# EAGLE design FPC-EMC01-1284 (EAGLE 6.6.0)
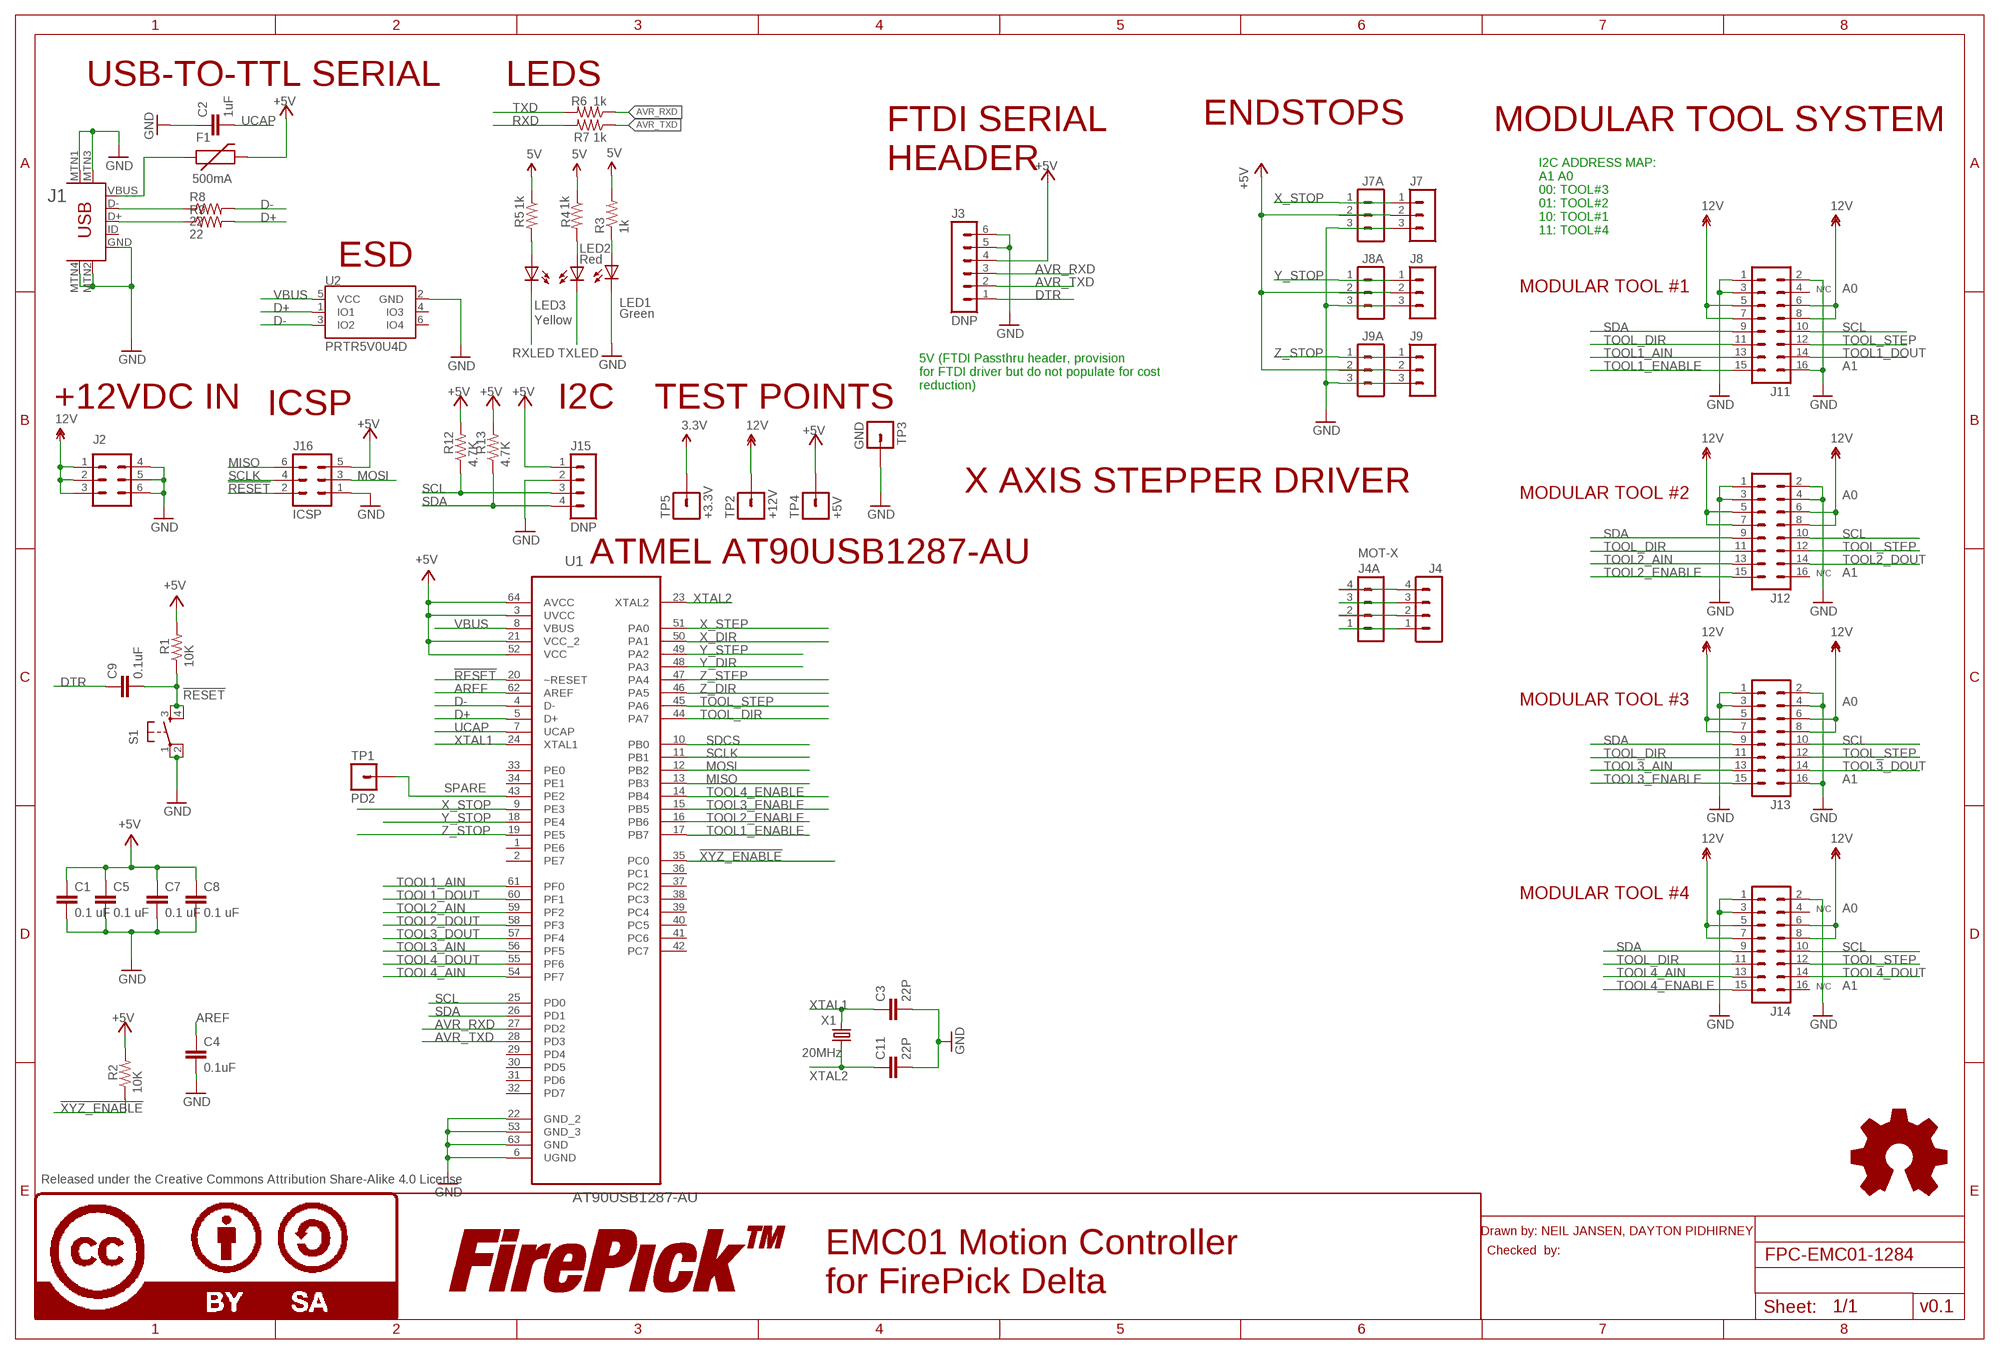
[diagram p0: schematic, sheet 1]

## Parts
C1  0.1 uF  CAP0805  [0805]
C2  1uF  CAP0805  [0805]
C3  22P  CAP0805  [0805]
C4  0.1uF  CAP0805  [0805]
C5  0.1 uF  CAP0805  [0805]
C7  0.1 uF  CAP0805  [0805]
C8  0.1 uF  CAP0805  [0805]
C9  0.1uF  CAP0805  [0805]
C11  22P  CAP0805  [0805]
F1  500mA  PTCSMD  [PTC-1206]
J1  USB-MINIB-5PIN  [USB-MINIB]
J2  CONN-MOLEX-MICROFIT-6PIN  [CONN-MOLEX-MINIFIT-6PIN-2ROW]
J3  DNP  MA06-1  [MA06-1]
J4  MA04-1  [MA04-1]
J4A  MOT-X  CONN-RECT-4PINJST-PH-2MM  [CONN-JST-PH_2.0MM_4PIN-SMT-RA]
J7  MA03-1  [MA03-1]
J7A  CONN-RECT-3PINJST_PH_2MM  [CONN-JST_PH-2.0MM-3PIN-SMT-RA]
J8  MA03-1  [MA03-1]
J8A  CONN-RECT-3PINJST_PH_2MM  [CONN-JST_PH-2.0MM-3PIN-SMT-RA]
J9  MA03-1  [MA03-1]
J9A  CONN-RECT-3PINJST_PH_2MM  [CONN-JST_PH-2.0MM-3PIN-SMT-RA]
J11  CONN-RECT-16PIN-2ROW  [CONN-RECT-2.54MM-16PIN-2ROW-SMTH]
J12  CONN-RECT-16PIN-2ROW  [CONN-RECT-2.54MM-16PIN-2ROW-SMTH]
J13  CONN-RECT-16PIN-2ROW  [CONN-RECT-2.54MM-16PIN-2ROW-SMTH]
J14  CONN-RECT-16PIN-2ROW  [CONN-RECT-2.54MM-16PIN-2ROW-SMTH]
J15  DNP  MA04-1  [MA04-1]
J16  ICSP  CONN-RECT-6PIN-2ROW  [CONN-RECT-2.54MM-6-PIN-2ROW-SMTH]
LED1  Green  LED1206-NS  [LED-1206-NO_SILK]
LED2  Red  LED1206-NS  [LED-1206-NO_SILK]
LED3  Yellow  LED1206-NS  [LED-1206-NO_SILK]
LOGO4  LOGO-FIREPICKLARGE  [LOGO-FIREPICK]
LOGO5  LOGO-OSHWMEDIUM  [LOGO-OSHW-MEDIUM]
LOGO6  LOGO-CC-BY-SALARGE  [LOGO-CC-BY-SA]
R1  10K  RESISTOR0805-RES  [0805]
R2  10K  RESISTOR0805-RES  [0805]
R3  1k  RESISTOR0805-RES  [0805]
R4  1k  RESISTOR0805-RES  [0805]
R5  1k  RESISTOR0805-RES  [0805]
R6  1k  RESISTOR0805-RES  [0805]
R7  1k  RESISTOR0805-RES  [0805]
R8  22  RESISTOR0805-RES  [0805]
R9  22  RESISTOR0805-RES  [0805]
R12  4.7K  RESISTOR0805-RES  [0805]
R13  4.7K  RESISTOR0805-RES  [0805]
S1  TAC_SWITCHSMD  [TACTILE_SWITCH_SMD]
TP1  PD2  CONN-TESTPOINT  [CON-TESTPOINT]
TP2  +12V  CONN-TESTPOINT  [CON-TESTPOINT]
TP3  GND  CONN-TESTPOINT  [CON-TESTPOINT]
TP4  +5V  CONN-TESTPOINT  [CON-TESTPOINT]
TP5  +3.3V  CONN-TESTPOINT  [CON-TESTPOINT]
U1  AT90USB1287-AU  [QFP80P1600X1600X120-64N]
U2  PRTR5V0U4D  [SOT23-6]
X1  20MHz  CRYSTALCTS406  [CTS406]

## Nets
3.3V: TP5.1
12V: J2.1 J2.2 J2.3 J11.5 J11.6 J11.7 J11.8 J12.5 J12.6 J12.7 J12.8 J13.5 J13.6 J13.7 J13.8 J14.5 J14.6 J14.7 J14.8 TP2.1
!RESET: C9.2 J16.2 R1.1 S1.3 S1.4 U1.20(~RESET)
!XYZ_ENABLE: R2.1 U1.35(PC0)
+5V [power]: C1.1 C5.1 C7.1 C8.1 F1.2 J3.4 J7.2 J7A.2 J8.2 J8A.2 J9.2 J9A.2 J15.1 J16.5 R1.2 R2.2 R3.2 R4.1 R5.1 R12.2 R13.2 TP4.1 U1.3(UVCC) U1.21(VCC_2) U1.52(VCC) U1.64(AVCC) ; supply symbol labelled 5V
AREF: C4.1 U1.62(AREF)
AVR_RXD: J3.3 R6.1 U1.27(PD2)
AVR_TXD: J3.2 R7.1 U1.28(PD3)
D+: R9.2 U1.5(D+) U2.1(IO1)
D-: R8.2 U1.4(D-) U2.3(IO2)
DTR: C9.1 J3.1
GND [power]: C1.2 C2.1 C3.2 C4.2 C5.2 C7.2 C8.2 C11.2 J1.GND J1.MTN1(MTN2) J1.MTN2(MTN3) J1.MTN3(MTN1) J1.MTN4 J2.4 J2.5 J2.6 J3.5 J3.6 J7.3 J7A.3 J8.3 J8A.3 J9.3 J9A.3 J11.1 J11.2 J11.3 J11.16 J12.1 J12.2 J12.3 J12.4 J13.1 J13.2 J13.3 J13.4 J13.16 J14.1 J14.2 J14.3 J15.2 J16.1 LED1.C S1.1 S1.2 TP3.1 U1.6(UGND) U1.22(GND_2) U1.53(GND_3) U1.63(GND) U2.2(GND)
MISO: J16.6 U1.13(PB3)
MOSI: J16.3 U1.12(PB2)
N$1: J1.D- R8.1
N$2: J1.D+ R9.1
N$4: LED1.A R3.1
N$21: LED2.A R4.2
N$22: LED3.A R5.2
RXD: R7.2
RXLED: LED3.C
SCL [power]: J11.10 J12.10 J13.10 J14.10 J15.3 R12.1 U1.25(PD0)
SCLK: J16.4 U1.11(PB1)
SDA [power]: J11.9 J12.9 J13.9 J14.9 J15.4 R13.1 U1.26(PD1)
SDCS: U1.10(PB0)
SPARE: TP1.1 U1.43(PE2)
TOOL1_AIN: J11.13 U1.61(PF0)
TOOL1_DOUT: J11.14 U1.60(PF1)
TOOL1_ENABLE: J11.15 U1.17(PB7)
TOOL2_AIN: J12.13 U1.59(PF2)
TOOL2_DOUT: J12.14 U1.58(PF3)
TOOL2_ENABLE: J12.15 U1.16(PB6)
TOOL3_AIN: J13.13 U1.56(PF5)
TOOL3_DOUT: J13.14 U1.57(PF4)
TOOL3_ENABLE: J13.15 U1.15(PB5)
TOOL4_AIN: J14.13 U1.54(PF7)
TOOL4_DOUT: J14.14 U1.55(PF6)
TOOL4_ENABLE: J14.15 U1.14(PB4)
TOOL_DIR: J11.11 J12.11 J13.11 J14.11 U1.44(PA7)
TOOL_STEP: J11.12 J12.12 J13.12 J14.12 U1.45(PA6)
TXD: R6.2
TXLED: LED2.C
UCAP: C2.2 U1.7(UCAP)
VBUS: U1.8(VBUS) U2.5(VCC)
VUSB: F1.1 J1.VBUS
X1A: J4.2 J4A.2
X1B: J4.1 J4A.1
X2A: J4.3 J4A.3
X2B: J4.4 J4A.4
X_DIR: U1.50(PA1)
X_STEP: U1.51(PA0)
X_STOP: J7.1 J7A.1 U1.9(PE3)
XTAL1: C3.1 U1.24(XTAL1) X1.3
XTAL2: C11.1 U1.23(XTAL2) X1.1
Y_DIR: U1.48(PA3)
Y_STEP: U1.49(PA2)
Y_STOP: J8.1 J8A.1 U1.18(PE4)
Z_DIR: U1.46(PA5)
Z_STEP: U1.47(PA4)
Z_STOP: J9.1 J9A.1 U1.19(PE5)
Unconnected: J1.ID J11.4 J12.16 J14.4 J14.16 U1.1(PE6) U1.2(PE7) U1.29(PD4) U1.30(PD5) U1.31(PD6) U1.32(PD7) U1.33(PE0) U1.34(PE1) U1.36(PC1) U1.37(PC2) U1.38(PC3) U1.39(PC4) U1.40(PC5) U1.41(PC6) U1.42(PC7) U2.4(IO3) U2.6(IO4)

## Notes on the sheet
- USB-TO-TTL SERIAL | LEDS
- ENDSTOPS | MODULAR TOOL SYSTEM
- FTDI SERIAL 
  HEADER
- J1
- I2C ADDRESS MAP:
  A1 A0
  00: TOOL#3
  01: TOOL#2
  10: TOOL#1
  11: TOOL#4
- ESD
- MODULAR TOOL #1 | N/C | A0
- A1
- 5V (FTDI Passthru header, provision
  for FTDI driver but do not populate for cost
  reduction)
- +12VDC IN | ICSP | I2C | TEST POINTS
- X AXIS STEPPER DRIVER
- MODULAR TOOL #2 | A0
- ATMEL AT90USB1287-AU
- N/C | A1
- MODULAR TOOL #3 | A0
- A1
- MODULAR TOOL #4
- N/C | A0
- N/C | A1
- Released under the Creative Commons Attribution Share-Alike 4.0 License
- Drawn by: NEIL JANSEN, DAYTON PIDHIRNEY
- Checked  by:
- EMC01 Motion Controller
  for FirePick Delta
- v0.1

## Library data of the parts
C1 C3-C5 C7-C9 C11 = SparkFun-Capacitors:CAP: Capacitor Standard 0603 ceramic capacitor, and 0.1" leaded capacitor.
C2 = SparkFun:CAP: Capacitor Standard 0603 ceramic capacitor, and 0.1" leaded capacitor.
F1 = SparkFun:PTC: Resettable Fuse PTC Resettable Fuse. Spark Fun Electronics SKU : COM-08357
J1 = SparkFun-Connectors:USB-MINIB: Mini-USB "B" connector with 5th pin broken out. Created new symbol breaking out 5th "ID" pin in mini/micro USB connector spec. See: http://en.wikipedia.org/wiki/Mini_usb#Cables. Uses same footprint as 4-pin symbol. Also added pins to connect to mounting / shield pads if required (probably not generally needed as signals aren't shielded once they leave the connector).
J2 = FirePick:CONN-MOLEX-MICROFIT-6PIN
J3 = !con-lstb:MA06-1: PIN HEADER
J4 J15 = !con-lstb:MA04-1: PIN HEADER
J4A = FirePick:CONN-RECT-4PIN
J7-J9 = !con-lstb:MA03-1: PIN HEADER
J7A J8A J9A = FirePick:CONN-RECT-3PIN
J11-J14 = FirePick:CONN-RECT-16PIN-2ROW
J16 = FirePick:CONN-RECT-6PIN-2ROW
LED1-LED3 = SparkFun-LED:LED: LEDs Standard schematic elements and footprints for 5mm, 3mm, 1206, and 0603 sized LEDs. 5mm - Spark Fun Electronics SKU : COM-00529 (and others)
LOGO4 = FirePick:LOGO-FIREPICK
LOGO5 = FirePick:LOGO-OSHW
LOGO6 = FirePick:LOGO-CC-BY-SA
R1-R7 R12 R13 = SparkFun-Resistors:RESISTOR: Resistor Basic schematic elements and footprints for 0603, 1206, and PTH resistors.
R8 R9 = SparkFun:RESISTOR: Resistor Basic schematic elements and footprints for 0603, 1206, and PTH resistors.
S1 = SparkFun:TAC_SWITCH: Momentary Switch Button commonly used for reset or general input. Spark Fun Electronics SKU : COM-00097
TP1-TP5 = FirePick:CONN-TESTPOINT
U1 = Atmel_By_element14_Batch_1-00:AT90USB1287-AU: MCU; DESCRIPTION: MCU; MPN: AT90USB1287-AU; OC_FARNELL: 1748496; OC_NEWARK: 26R5676; PACKAGE: QFP-64; SUPPLIER: Atmel
U2 = printrbot:PRTR5V0U4D
X1 = adafruit:CRYSTAL: CRYSTAL; OC_FARNELL: unknown; OC_NEWARK: unknown

## Net classes
2 power-12V: width 0.3 mm, drill 0.3 mm, clearance 0.3 mm

## Board
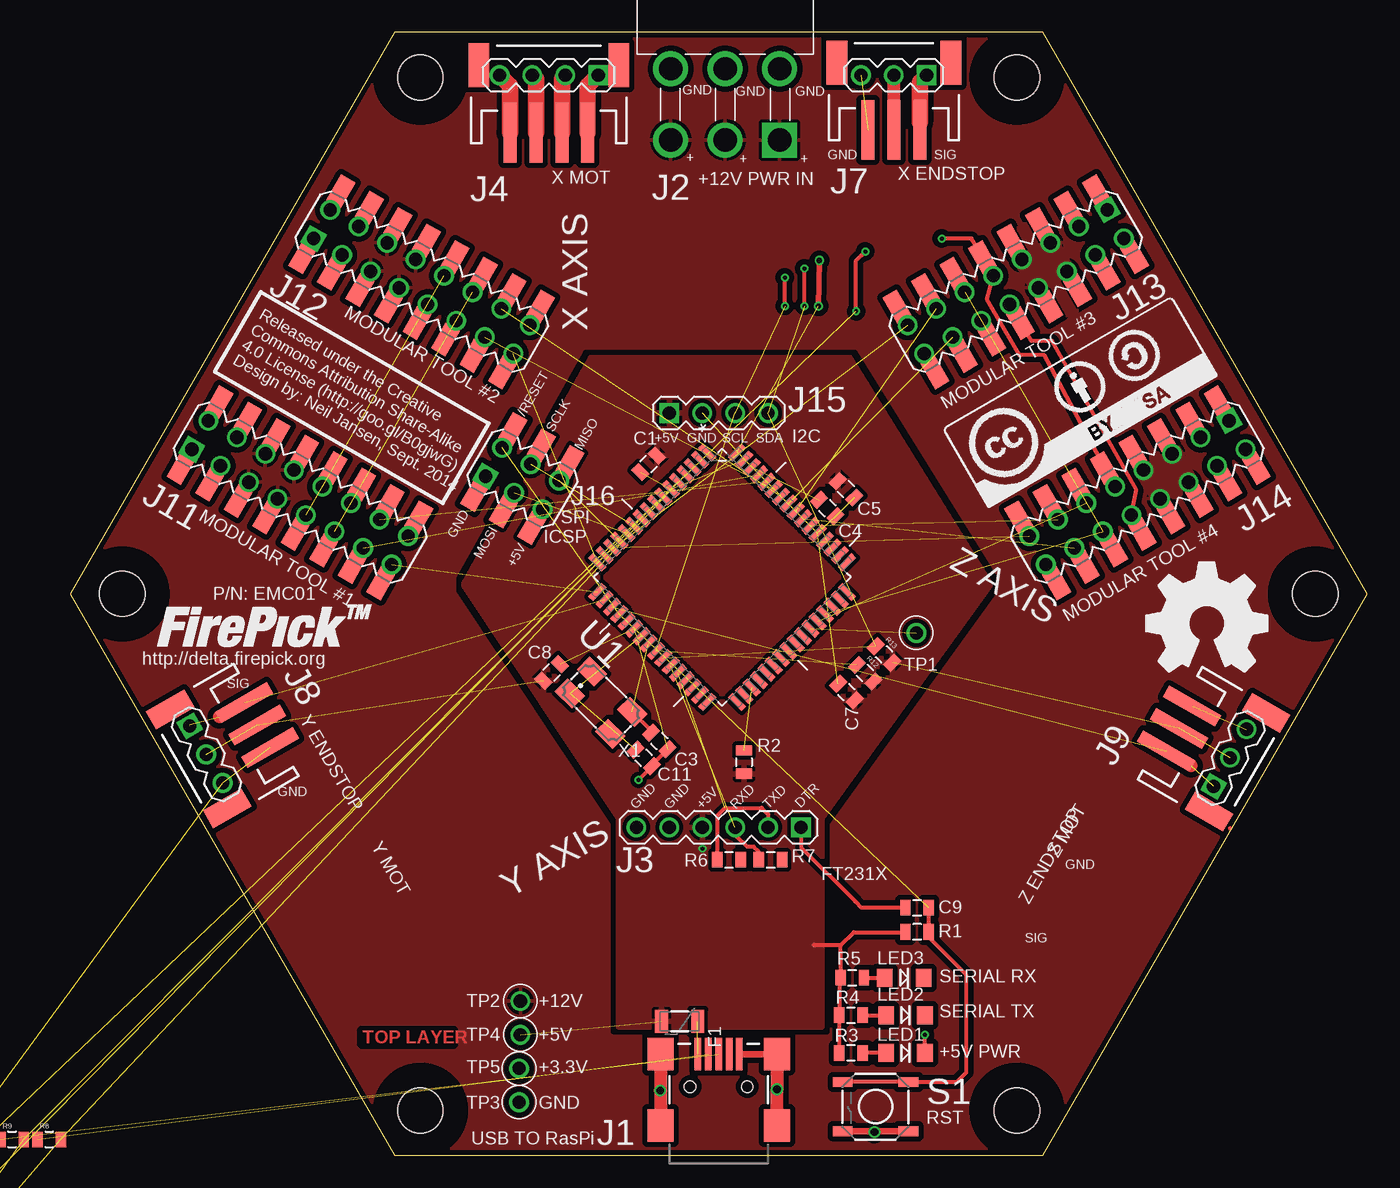
[diagram p1: board, top side]
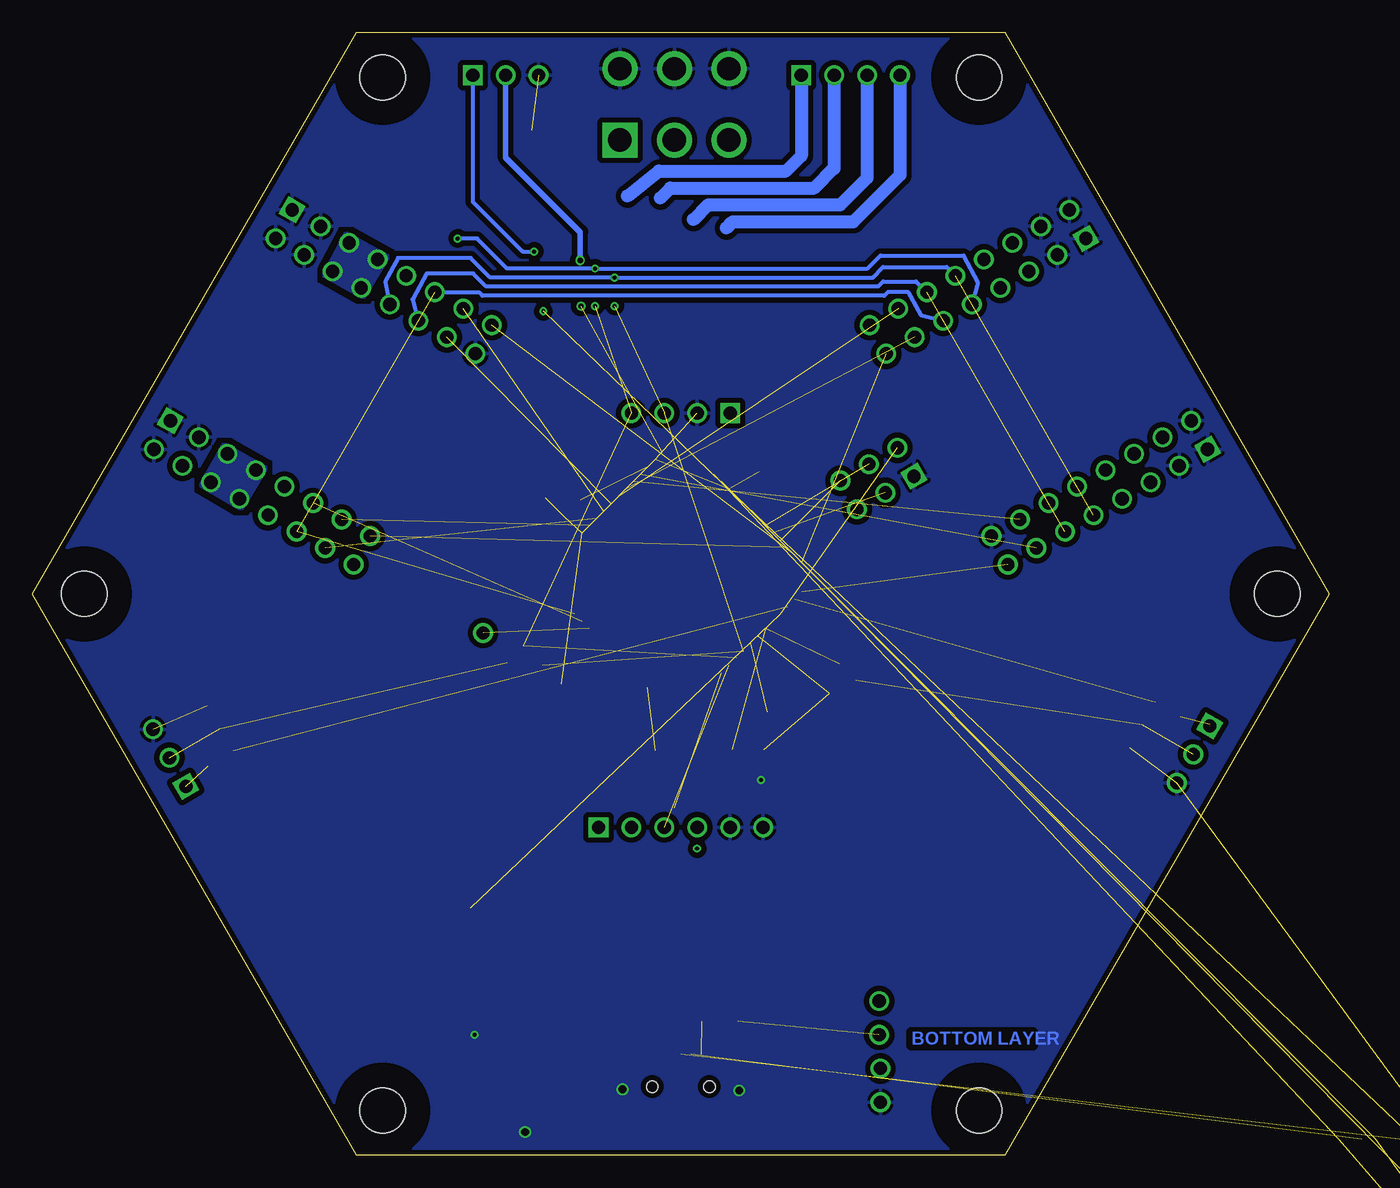
[diagram p2: board, bottom side, seen from below]

Size 100 x 86.6 mm. Coordinates in mm from the lower left corner, seen from the top.
Outline: 25,0 75,0 100,43.3 75,86.6 25,86.6 0,43.3 25,0
Copper layers (1*16): Top 0.035mm / dielectric 1.5mm / Bottom 0.035mm
Design rules "SeeedStudio_2layer_DRU_no_angle_20140221": minimum track width 6mil, minimum drill 12mil, track to track 6mil, track to pad 6mil, pad to pad 6mil, via to via 6mil, smd to smd 0mil, copper to edge 10mil, drill to drill 10mil, minimum pad ring 10mil, minimum via ring 6mil, stop-mask expansion 2mil, vias tented up to drill 100mil, thermal gap 10mil
Holes 3.5 mm at 4,43.3 27,3.46 73,3.46 96,43.3 27,83.14 73,83.14
tRestrict: area 92.8,40.1 to 99.2,46.6; area 0.8,40.1 to 7.2,46.6; area 69.8,0.2 to 76.2,6.7; area 23.8,79.9 to 30.2,86.4; area 69.8,79.9 to 76.2,86.4; area 23.8,0.2 to 30.2,6.7
bRestrict: area 0.8,40.1 to 7.2,46.6; area 69.8,79.9 to 76.2,86.4; area 92.8,40.1 to 99.2,46.6; area 23.8,0.2 to 30.2,6.7; area 69.8,0.2 to 76.2,6.7; area 23.8,79.9 to 30.2,86.4

### Footprints (pad centres in the part's own frame; a part is rotated, then mirrored left to right if it is on the bottom)
0805 = smd 0.8 x 1.2: 1 -0.9,0; 2 0.9,0
PTC-1206 = smd 1 x 1.8: 1 -1.4,0; 2 1.4,0
USB-MINIB = smd 2.5 x 0.5: D+ 2.5,0; D- 2.5,0.8; GND 2.5,-1.6; ID 2.5,-0.8; VBUS 2.5,1.6 | smd 2.5 x 2: MTN1 -3,4.5; MTN2 2.5,4.5; MTN3 -3,-4.5; MTN4 2.5,-4.5 | hole 0.9: 0,2.2; 0,-2.2
CONN-MOLEX-MINIFIT-6PIN-2ROW = drill 1.8 square: 1 4.2,0 | drill 1.8: 2 0,0; 3 -4.2,0; 4 4.2,5.5; 5 0,5.5; 6 -4.2,5.5
MA06-1 = drill 1.016 square: 1 -6.35,0 | drill 1.016: 2 -3.81,0; 3 -1.27,0; 4 1.27,0; 5 3.81,0; 6 6.35,0
MA04-1 = drill 1.016 square: 1 -3.81,0 | drill 1.016: 2 -1.27,0; 3 1.27,0; 4 3.81,0
CONN-JST-PH_2.0MM_4PIN-SMT-RA = smd 1 x 4.6: 1 3,-2.43; 2 1,-2.43; 3 -1,-2.43; 4 -3,-2.43 | smd 1.6 x 3.4: NC1 -5.4,2.77; NC2 5.4,2.77
MA03-1 = drill 1.016 square: 1 -2.54,0 | drill 1.016: 2 0,0; 3 2.54,0
CONN-JST_PH-2.0MM-3PIN-SMT-RA = smd 1 x 4.6: 1 2.01,-2.23; 2 0.01,-2.23; 3 -1.99,-2.23 | smd 1.6 x 3.4: NC1 -4.39,2.97; NC2 4.41,2.97
CONN-RECT-2.54MM-16PIN-2ROW-SMTH = drill 1.016 square: 1 -8.89,-1.27 | drill 1.016: 2 -8.89,1.27; 3 -6.35,-1.27; 4 -6.35,1.27; 5 -3.81,-1.27; 6 -3.81,1.27; 7 -1.27,-1.27; 8 -1.27,1.27; 9 1.27,-1.27; 10 1.27,1.27; 11 3.81,-1.27; 12 3.81,1.27; 13 6.35,-1.27; 14 6.35,1.27; 15 8.89,-1.27; 16 8.89,1.27 | smd 1.27 x 2.3: P1 -8.89,-2.93; P2 -8.89,2.93; P3 -6.35,-2.93; P4 -6.35,2.93; P5 -3.81,-2.93; P6 -3.81,2.93; P7 -1.27,-2.93; P8 -1.27,2.93; P9 1.27,-2.93; P10 1.27,2.93; P11 3.81,-2.93; P12 3.81,2.93; P13 6.35,-2.93; P14 6.35,2.93; P15 8.89,-2.93; P16 8.89,2.93
CONN-RECT-2.54MM-6-PIN-2ROW-SMTH = drill 1.016 square: 1 -2.54,-1.27 | drill 1.016: 2 -2.54,1.27; 3 0,-1.27; 4 0,1.27; 5 2.54,-1.27; 6 2.54,1.27 | smd 1.27 x 2.3: P1 -2.54,-2.93; P2 -2.54,2.93; P3 0,-2.93; P4 0,2.93; P5 2.54,-2.93; P6 2.54,2.93
LED-1206-NO_SILK = smd 1.2 x 1.4: A -1.5,0; C 1.5,0
TACTILE_SWITCH_SMD = smd 1.524 x 0.762: 1 -2.54,1.905; 2 2.54,1.905; 3 -2.54,-1.905; 4 2.54,-1.905
CON-TESTPOINT = drill 1.016: 1 0,0
QFP80P1600X1600X120-64N = smd 1.473 x 0.508: 1 -7.62,5.994; 2 -7.62,5.207; 3 -7.62,4.394; 4 -7.62,3.607; 5 -7.62,2.794; 6 -7.62,2.007; 7 -7.62,1.194; 8 -7.62,0.406; 9 -7.62,-0.406; 10 -7.62,-1.194; 11 -7.62,-2.007; 12 -7.62,-2.794; 13 -7.62,-3.607; 14 -7.62,-4.394; 15 -7.62,-5.207; 16 -7.62,-5.994; 33 7.62,-5.994; 34 7.62,-5.207; 35 7.62,-4.394; 36 7.62,-3.607; 37 7.62,-2.794; 38 7.62,-2.007; 39 7.62,-1.194; 40 7.62,-0.406; 41 7.62,0.406; 42 7.62,1.194; 43 7.62,2.007; 44 7.62,2.794; 45 7.62,3.607; 46 7.62,4.394; 47 7.62,5.207; 48 7.62,5.994 | smd 0.508 x 1.473: 17 -5.994,-7.62; 18 -5.207,-7.62; 19 -4.394,-7.62; 20 -3.607,-7.62; 21 -2.794,-7.62; 22 -2.007,-7.62; 23 -1.194,-7.62; 24 -0.406,-7.62; 25 0.406,-7.62; 26 1.194,-7.62; 27 2.007,-7.62; 28 2.794,-7.62; 29 3.607,-7.62; 30 4.394,-7.62; 31 5.207,-7.62; 32 5.994,-7.62; 49 5.994,7.62; 50 5.207,7.62; 51 4.394,7.62; 52 3.607,7.62; 53 2.794,7.62; 54 2.007,7.62; 55 1.194,7.62; 56 0.406,7.62; 57 -0.406,7.62; 58 -1.194,7.62; 59 -2.007,7.62; 60 -2.794,7.62; 61 -3.607,7.62; 62 -4.394,7.62; 63 -5.207,7.62; 64 -5.994,7.62
SOT23-6 = smd 0.6 x 0.9: 1 -0.95,-1.15; 2 0,-1.15; 3 0.95,-1.15; 4 0.95,1.15; 5 0,1.15; 6 -0.95,1.15
CTS406 = smd 1.9 x 1.4: 1 -2.2,-1.2; 2 2.2,-1.2; 3 2.2,1.2; 4 -2.2,1.2

### Placement (x,y rotation side)
C1  44.59,53.33 225 top
C2  -7.52,1.23 0 top  (outside the outline)
C3  45.42,31.95 315 top
C4  58.37,49.92 315 top
C5  59.82,51.37 315 top
C7  59.84,35.73 135 top
C8  37.12,37.25 45 top
C9  65.3,19.1 0 top
C11  44.22,30.65 315 top
F1  46.98,10.34 180 top
J1  50,5.3 90 top
J2  50.5,78.3 0 top
J3  50,25.3 180 top
J4  36.9,83.3 180 top
J4A  36.9,81.3 0 top
J7  63.5,83.3 180 top
J7A  63.5,81.3 0 top
J8  10.48,30.93 300 top
J8A  12.48,32.05 120 top
J9  89.43,30.66 60 top
J9A  87.44,31.81 240 top
J11  17.7,51.11 330 top
J12  27.09,67.37 330 top
J13  72.91,67.37 210 top
J14  82.3,51.11 210 top
J15  50,57.25 0 top
J16  34.85,52.2 330 top
LED1  64.4,7.9 0 top
LED2  64.4,10.8 0 top
LED3  64.3,13.7 0 top
LOGO4  6.5,37.5 0 top
LOGO5  87.65,41.07 0 top
LOGO6  70.8,49.9 30 top
R1  65.3,17.23 180 top
R2  51.95,30.33 270 top
R3  60.2,7.9 180 top
R4  60.2,10.8 0 top
R5  60.3,13.7 0 top
R6  54,22.8 0 top
R7  50.8,22.8 0 top
R8  -1.63,1.23 0 top
R9  -4.5,1.23 0 top  (outside the outline)
R12  61.29,37.19 315 top
R13  62.75,38.64 315 top
S1  62.1,3.75 180 top
TP1  65.24,40.29 180 top
TP2  34.7,11.9 0 top
TP3  34.6,4.1 0 top
TP4  34.7,9.3 0 top
TP5  34.6,6.7 0 top
U1  50.27,44.58 315 top
U2  -7.14,-3.88 0 top  (outside the outline)
X1  40.93,34.91 315 top

### Tracks (layer width: path | path; a pad name or v marks a point on that pad's centre or on a via)
12V
  pour Top (no thermals): 71.8,70.8 75.7,64.1 78.8,65.8 74.9,72.6
  pour Bottom (no thermals): 75.8,71.1 72.6,69.3 74.5,66.2 77.5,67.9
  pour Bottom (no thermals): 85.2,54.8 82,53 83.9,49.9 87,51.7
  pour Top (no thermals): 85.2,55 82,53.1 83.9,50 86.9,51.8
  pour Top (isolate 0.406, rank 2): 25.1,86.6 0.1,43.2 25.1,-0.1 75.1,0 100.1,43.3 75.1,86.6
!RESET  (2 unrouted)
  Top 0.3: C9.2 R1.1 66.2,16.8 69.1,13.9 69.1,6.4 68.36,5.66 S1.3 S1.4
!XYZ_ENABLE  (1 unrouted)
+5V  (via drill 0.3, 0.41)  (6 unrouted)
  Top 0.3: 59.4,15.7 R5.1 | R3.2 R4.1
  Top 0.305: TP4.1 | 59.4,15.7 59.4,16.18 | 59.4,16.18 60.43,17.2 64.4,17.2 R1.2 | R5.1 59.3,13.7 R4.1 | 59.4,16.18 57.35,16.18 57.35,16.26
  Top 0.406: v57.68,65.49 v57.76,69.02
  Top 1: J7A.2 J7.2
  Bottom 0.406: J7.2 63.51,76.95 57.76,71.2 v57.76,69.02
  Bottom 1: J7.2
  other vias: 48.74,23.65
  pour Top (isolate 0.305): 60.1,61.51 70.99,44.04 57.97,25.98 57.97,9.9 42.29,9.9 42.29,25.98 30.28,44.04 40.1,61.51
AREF  (1 unrouted)
AVR_RXD  (1 unrouted)
  Top 0.3: R6.1 53.1,23.4 52.7,23.8 52.2,23.8 51.27,24.73 J3.3
AVR_TXD  (1 unrouted)
  Top 0.3: R7.1 49.9,26.2 50.5,26.8 53.3,26.8 53.8,26.3 J3.2
D+  (2 unrouted)
D-  (2 unrouted)
DTR
  Top 0.3: 64.3,19 C9.1 | J3.1 56.35,23.75 60.52,19.58
  Top 0.305: 60.52,19.58 60.96,19.13 64.4,19.13 C9.1
GND  (via drill 0.3, 0.6)  (14 unrouted)
  Top 0.3: LED1.C v65.9,9.3 | C3.2 44.85,30.11 C11.2 44.85,29.99 v43.82,28.95
  Top 0.5: S1.2 61.95,1.85 v62,1.8 62.05,1.85 S1.1 | J1.GND J1.MTN4
  Top 1: J1.MTN3 v54.5,5.1 J1.MTN4
  Top 1.016: J1.MTN2 v45.5,5 J1.MTN1
  pour Bottom (isolate 0.406, rank 2): 25,86.6 0,43.2 25,-0.1 75,0 100,43.3 75,86.6
MISO  (1 unrouted)
MOSI  (1 unrouted)
N$1  (1 unrouted)
N$2  (1 unrouted)
N$4
  Top 0.3: LED1.A R3.1
N$11
  Top 0.305: 89.43,25.18 89.43,25.23
N$21
  Top 0.3: R4.2 LED2.A
N$22
  Top 0.3: 61.1,13.7 R5.2 LED3.A
SCL  (via drill 0.3)  (4 unrouted)
  Top 0.3: J14.10 82.2,51.3 75.7,62.8 74.1,62.8 J13.10 | v55.1,65.5 v55.1,67.7
  Bottom 0.3: J12.10 29.5,68.5 34.4,68.5 35.2,67.7 v55.1,67.7 64.7,67.7 66.2,69.2 71.8,69.2 72.8,67.4 J13.10
SCLK  (1 unrouted)
SDA  (via drill 0.3)  (4 unrouted)
  Top 0.3: J14.9 75.1,61.7 73.2,61.7 70.7,66 J13.9 69.5,70.7 v67.2,70.7 | v56.6,65.5 v56.6,68.4
  Bottom 0.3: J12.9 27.1,67.3 28.2,69.4 34.6,69.4 35.6,68.4 v56.6,68.4 63.4,68.4 65.7,70.7 v67.2,70.7
SPARE  (1 unrouted)
TOOL1_AIN  (1 unrouted)
TOOL1_DOUT  (1 unrouted)
TOOL1_ENABLE  (1 unrouted)
TOOL2_AIN  (1 unrouted)
TOOL2_DOUT  (1 unrouted)
TOOL2_ENABLE  (1 unrouted)
TOOL3_AIN  (1 unrouted)
TOOL3_DOUT  (1 unrouted)
TOOL3_ENABLE  (1 unrouted)
TOOL4_AIN  (1 unrouted)
TOOL4_DOUT  (1 unrouted)
TOOL4_ENABLE  (1 unrouted)
TOOL_DIR  (3 unrouted)
  Bottom 0.3: J13.11 65.56,66.56 65.3,66.3 34.3,66.3 34,66.6 32.5,66.6 31.5,64.8 J12.11
TOOL_STEP  (3 unrouted)
  Bottom 0.3: J13.12 70.7,66 69.6,68 66,68 65,67 34.8,67 34.4,67.4 31.87,67.4 J12.12
UCAP  (1 unrouted)
VBUS  (1 unrouted)
VUSB  (1 unrouted)
X1A
  Top 1: J4A.2 37.9,81.1
  Top 1.27: J4.2 37.9,83.03 J4A.2
  Bottom 1: 51.57,73.83 50.8,74.6 39.7,74.6 38.17,76.13 J4.2
X1B
  Top 1: J4A.1 39.9,81
  Top 1.27: J4.1 39.9,82.49 J4A.1
  Bottom 1: 54.11,73.99 51.7,75.9 41.9,75.9 40.71,77.09 J4.1
X2A
  Top 1: J4A.3 35.9,81.03
  Top 1.27: J4.3 35.9,83.03 J4A.3
  Bottom 1: 49.03,72.17 47.9,73.3 37.7,73.3 35.63,75.37 J4.3
X2B
  Top 1: J4A.4 33.9,80.7
  Top 1.27: J4.4 33.9,82.49 J4A.4
  Bottom 1: 46.49,71.51 46,72 36.7,72 33.09,75.61 J4.4
X_STOP  (via drill 0.3)  (1 unrouted)
  Top 0.3: 61,69.4 v61.3,69.7 60.6,69 v60.6,65.1
  Top 1: 65.5,81.2 65.51,79.66 J7A.1
  Top 1.27: J7.1 65.51,82.77 65.51,79.66
  Bottom 0.3: J7.1 66.04,73.54 62.2,69.7 v61.3,69.7
XTAL1  (1 unrouted)
  Top 0.3: X1.3 44.78,32.75 C3.1
XTAL2  (2 unrouted)
Y_STOP  (via drill 0.6)  (3 unrouted)
  Top 1: 11.48,33.83 J8A.1
  Bottom 0.406: J8.1 9.21,33.25
  other vias: 9.21,33.12
Z_STOP  (2 unrouted)
  Top 1: 86.43,30.04 J9A.1
  Bottom 0.305: 88.06,28.35 J9.1

### Text on the board
Top: TOP LAYER
Bottom: BOTTOM LAYER
tPlace: GND | GND | GND | GND | SIG | + | + | + | X MOT | +12V PWR IN | X ENDSTOP | MODULAR TOOL #2 | X AXIS | Released under the Creative / Commons Attribution Share-Alike / 4.0 License (http://goo.gl/B0gjwG) / Design by: Neil Jansen, Sept. 2014 | /RESET | MODULAR TOOL #3 | SCLK | +5V | GND | SCL | SDA | I2C | MISO | GND | MODULAR TOOL #1 | MOSI | SPI | +5V | ICSP | P/N: EMC01 | Z AXIS | MODULAR TOOL #4 | http://delta.firepick.org | SIG | Y ENDSTOP | GND | GND | GND | +5V | RXD | TXD | DTR | Y MOT | Z MOT | GND | FT231X | Y AXIS | Z ENDSTOP | SIG | SERIAL RX | +12V | SERIAL TX | +5V | +5V PWR | +3.3V | GND | RST | USB TO RasPi